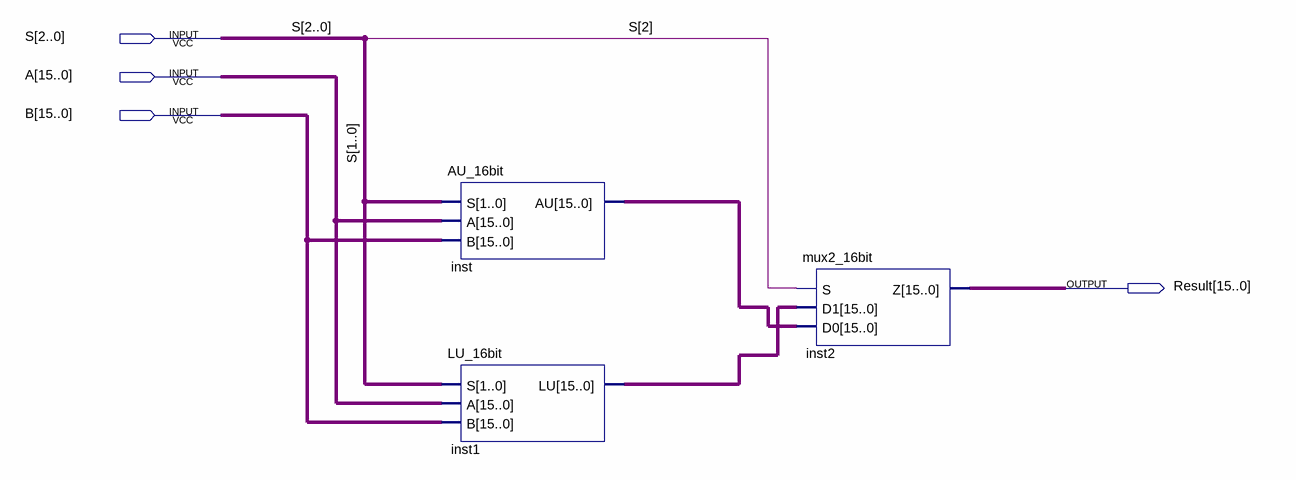
[diagram p0: schematic sheet]
// Quartus schematic ALU_16BIT.bdf as structural Verilog: 3 symbols, 4 pins
module ALU_16BIT (
  input  [2:0] S,
  input  [15:0] A,
  input  [15:0] B,
  output [15:0] Result
);

  wire [15:0] inst1_lu, inst_au;

  AU_16bit inst (.S(S[1:0]), .A(A), .B(B), .AU(inst_au));
  LU_16bit inst1 (.S(S[1:0]), .A(A), .B(B), .LU(inst1_lu));
  mux2_16bit inst2 (.S(S[2]), .D1(inst1_lu), .D0(inst_au), .Z(Result));
endmodule
